# EAGLE design wt32i_breakout_board_v30 (EAGLE 7.5.0)
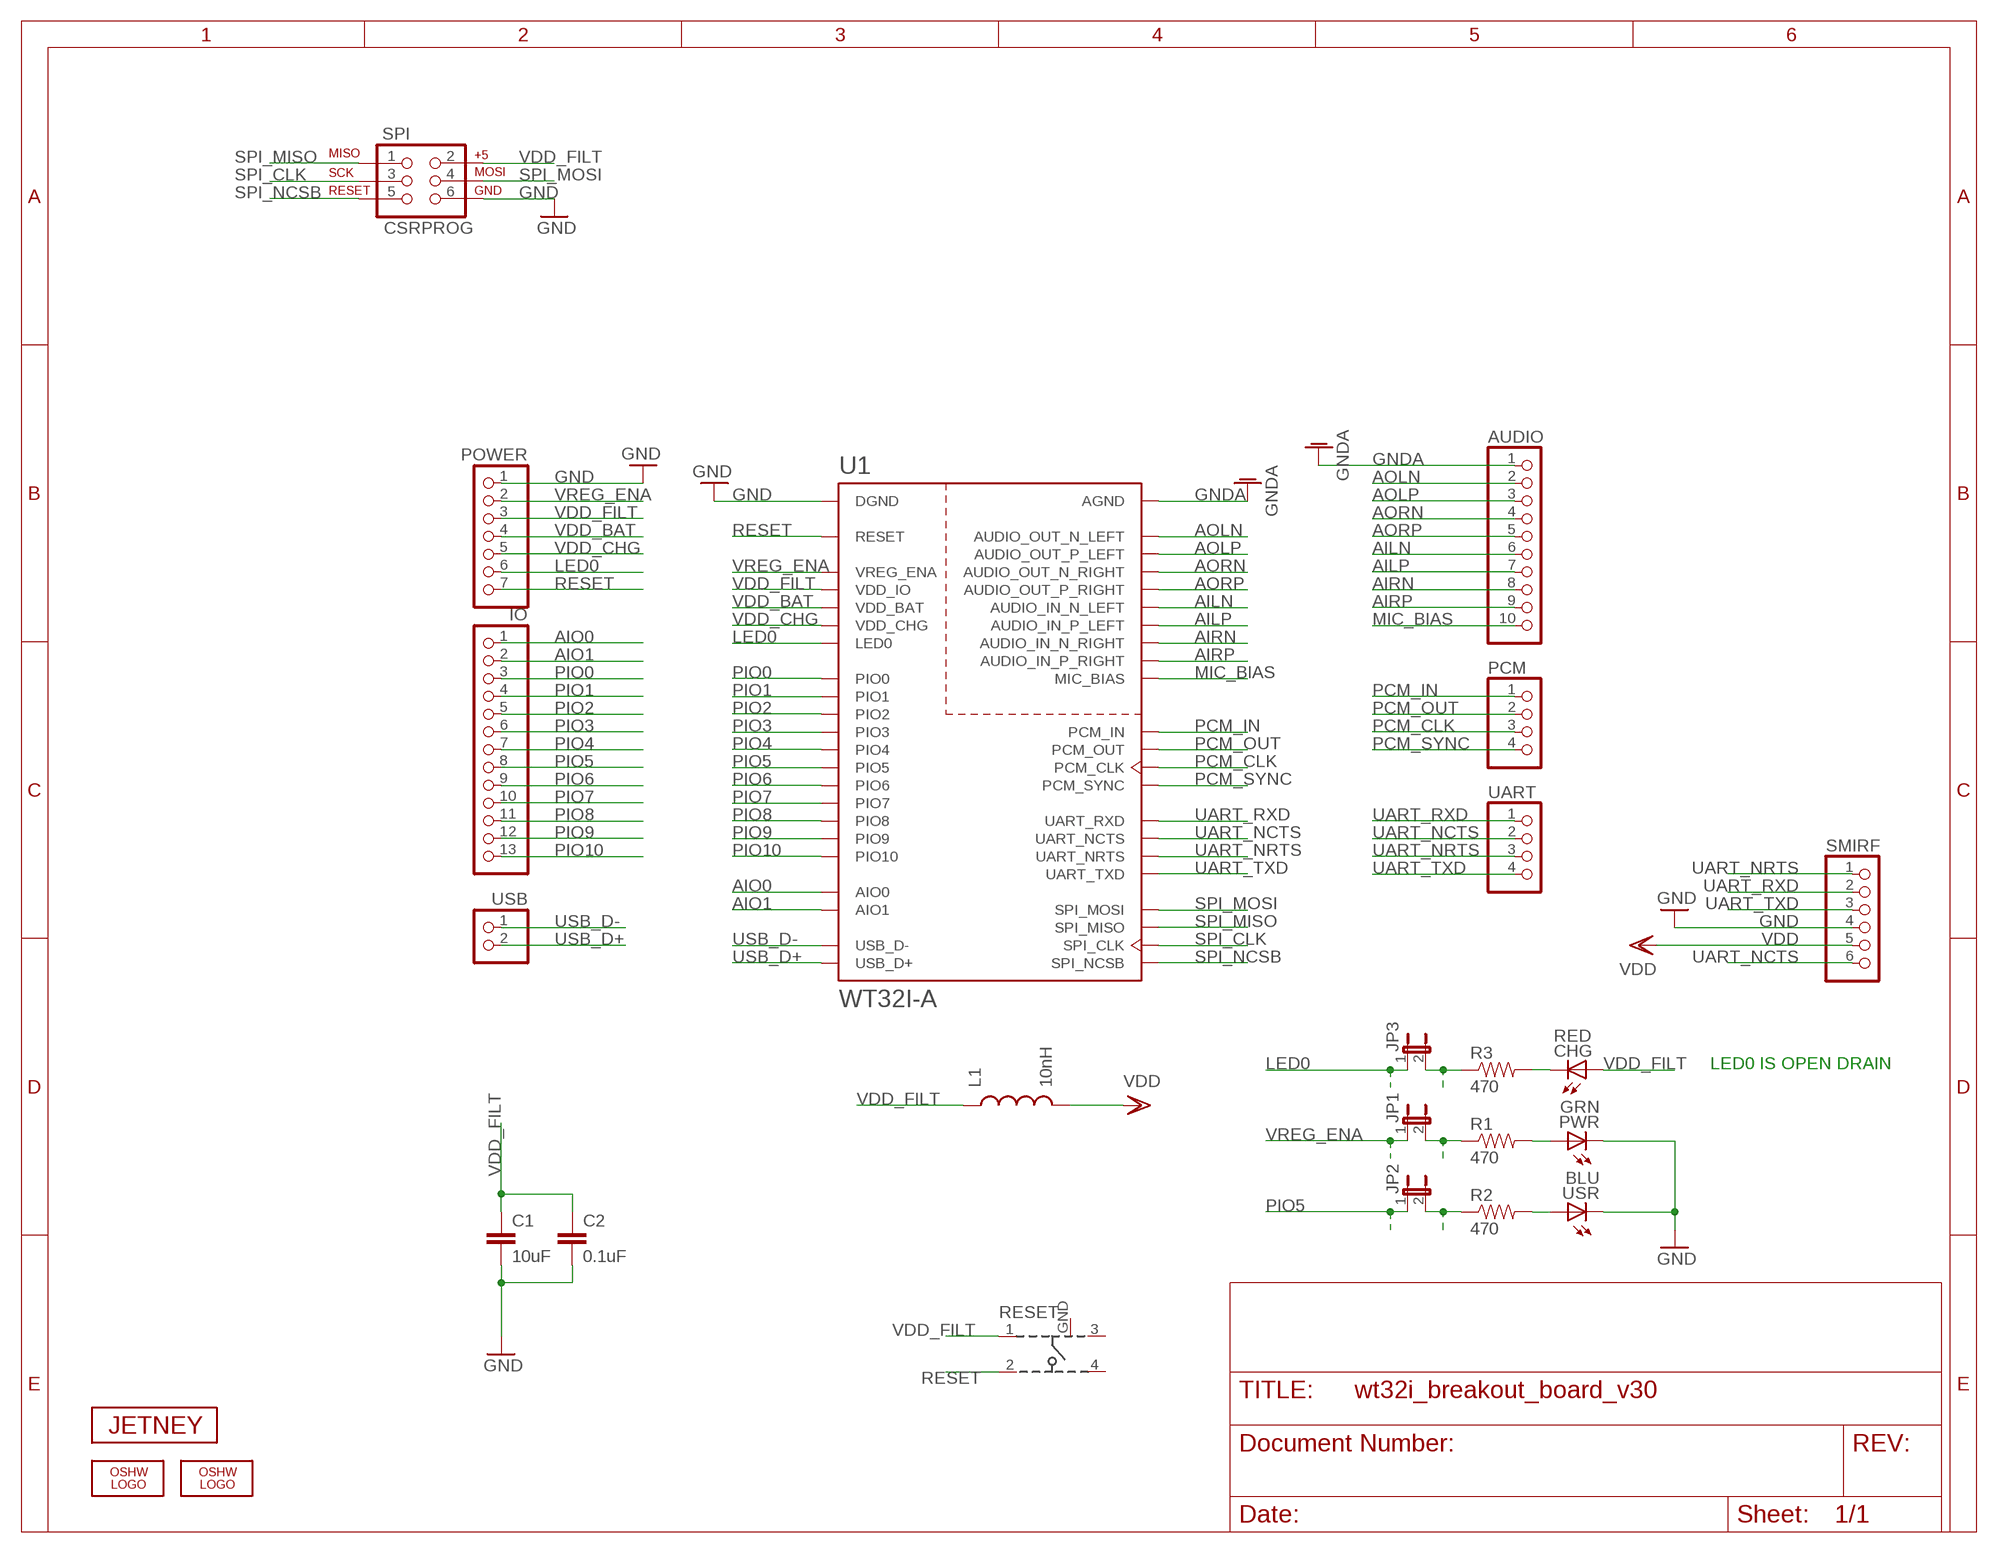
[diagram p0: schematic, sheet 1]

## Parts
AUDIO  PINHD-1X10  [1X10]
C1  10uF  CAP0603-CAP  [0603-CAP]
C2  0.1uF  CAP0603-CAP  [0603-CAP]
CHG  RED  LEDCHIPLED_0805  [CHIPLED_0805]
IO  PINHD-1X13  [1X13]
JP1  JUMPER-2SMD-NC  [SJ_2S]
JP2  JUMPER-2SMD-NC  [SJ_2S]
JP3  JUMPER-2SMD-NC  [SJ_2S]
L1  10nH  INDUCTOR0603  [0603]
LOGO1  OSHW_LOGO_FILLX0070-NT  [OSHW_FILLX70_NOTEXT]
LOGO2  OSHW_LOGO_FILLX0070-NT  [OSHW_FILLX70_NOTEXT]
PCM  PINHD-1X4  [1X04]
POWER  PINHD-1X7  [1X07]
PWR  GRN  LEDCHIPLED_0805  [CHIPLED_0805]
R1  470  RESISTOR0603-RES  [0603-RES]
R2  470  RESISTOR0603-RES  [0603-RES]
R3  470  RESISTOR0603-RES  [0603-RES]
RESET  101-IG  [101-IG]
SMIRF  PINHD-1X6  [1X06]
SPI  CSRPROG  AVR_SPI_PRG_6PTH  [2X3]
U1  WT32I-A  [WT32I-A]
U$2  JETNEY-LOGO-12  [JETNEY-LOGO-12]
UART  PINHD-1X4  [1X04]
USB  PINHD-1X2  [1X02]
USR  BLU  LEDCHIPLED_0805  [CHIPLED_0805]

## Nets
AILN: AUDIO.6 U1.AUDIO_IN_N_LEFT
AILP: AUDIO.7 U1.AUDIO_IN_P_LEFT
AIO0: IO.1 U1.AIO0
AIO1: IO.2 U1.AIO1
AIRN: AUDIO.8 U1.AUDIO_IN_N_RIGHT
AIRP: AUDIO.9 U1.AUDIO_IN_P_RIGHT
AOLN: AUDIO.2 U1.AUDIO_OUT_N_LEFT
AOLP: AUDIO.3 U1.AUDIO_OUT_P_LEFT
AORN: AUDIO.4 U1.AUDIO_OUT_N_RIGHT
AORP: AUDIO.5 U1.AUDIO_OUT_P_RIGHT
GND [power]: C1.2 C2.2 POWER.1 PWR.C SMIRF.4 SPI.6 U1.DGND U1.DGND@2(DGND) U1.DGND@3(DGND) U1.DGND@4(DGND) U1.DGND@5(DGND) USR.C
GNDA: AUDIO.1 U1.AGND U1.AGND@2(AGND) U1.AGND@3(AGND)
LED0: JP3.1 POWER.6 U1.LED0
MIC_BIAS: AUDIO.10 U1.MIC_BIAS
N$1: PWR.A R1.2
N$2: CHG.C R3.2
N$3: R2.2 USR.A
N$4: JP2.2 R2.1
N$7: JP3.2 R3.1
PCM_CLK: PCM.3 U1.PCM_CLK
PCM_IN: PCM.1 U1.PCM_IN
PCM_OUT: PCM.2 U1.PCM_OUT
PCM_SYNC: PCM.4 U1.PCM_SYNC
PIO0: IO.3 U1.PIO0
PIO1: IO.4 U1.PIO1
PIO2: IO.5 U1.PIO2
PIO3: IO.6 U1.PIO3
PIO4: IO.7 U1.PIO4
PIO5: IO.8 JP2.1 U1.PIO5
PIO6: IO.9 U1.PIO6
PIO7: IO.10 U1.PIO7
PIO8: IO.11 U1.PIO8
PIO9: IO.12 U1.PIO9
PIO10: IO.13 U1.PIO10
RESET: POWER.7 RESET.2 U1.RESET
SPI_CLK: SPI.3 U1.SPI_CLK
SPI_MISO: SPI.1 U1.SPI_MISO
SPI_MOSI: SPI.4 U1.SPI_MOSI
SPI_NCSB: SPI.5 U1.SPI_NCSB
UART_NCTS: SMIRF.6 U1.UART_NCTS UART.2
UART_NRTS: SMIRF.1 U1.UART_NRTS UART.3
UART_RXD: SMIRF.2 U1.UART_RXD UART.1
UART_TXD: SMIRF.3 U1.UART_TXD UART.4
USB_D+: U1.USB_D+ USB.2
USB_D-: U1.USB_D- USB.1
VDD [power]: L1.2 SMIRF.5
VDD_BAT [power]: POWER.4 U1.VDD_BAT
VDD_CHG: POWER.5 U1.VDD_CHG
VDD_FILT [power]: C1.1 C2.1 CHG.A L1.1 POWER.3 RESET.1 SPI.2 U1.VDD_IO
VDDJP1 [power]: JP1.2 R1.1
VREG_ENA: JP1.1 POWER.2 U1.VREG_ENA
Unconnected: RESET.3 RESET.4

## Notes on the sheet
- LED0 IS OPEN DRAIN

## Power pins joined to a net without a drawn wire
GND: RESET.GND

## Library data of the parts
AUDIO = sf-pinhead:PINHD-1X10: PIN HEADER
C1 C2 = SparkFun:CAP: Capacitor Standard 0603 ceramic capacitor, and 0.1" leaded capacitor.
CHG PWR USR = adafruit:LED: LED OSRAM: - CHIPLED LG R971, LG N971, LY N971, LG Q971, LY Q971, LO R971, LY R971 LH N974, LH R974 LS Q976, LO Q976, LY Q976 LO Q996 - Hyper CHIPLED LW Q18S LB Q993, LB Q99A, LB R99A - SideLED LS A670, LO A670, LY A670, LG A670, LP A670 LB A673, LV A673, LT A673, LW A673 LH A674 LY A675 LS A676, LA A676, LO A676, LY A676, LW A676 LS A679, LY A679, LG A679 - Hyper Micro SIDELED® LS Y876, LA Y876, LO Y876, LY Y876 LT Y87S - SmartLED LW L88C, LW L88S LB L89C, LB L89S, LG L890 LS L89K, LO L89K, LY L89K LS L896, LA L896, LO L896, LY L896 - TOPLED LS T670, LO T670, LY T670, LG T670, LP T670 LSG T670, LSP T670, LSY T670, LOP T670, LYG T670 LG T671, LOG T671, LSG T671 LB T673, LV T673, LT T673, LW T673 LH T674 LS T676, LA T676, LO T676, LY T676, LB T676, LH T676, LSB T676, LW T676 LB T67C, LV T67C, LT T67C, LS T67K, LO T67K, LY T67K, LW E67C LS E67B, LA E67B, LO E67B, LY E67B, LB E67C, LV E67C, LT E67C LW T67C LS T679, LY T679, LG T679 LS T770, LO T770, LY T770, LG T770, LP T770 LB T773, LV T773, LT T773, LW T773 LH T774 LS E675, LA E675, LY E675, LS T675 LS T776, LA T776, LO T776, LY T776, LB T776 LHGB T686 LT T68C, LB T68C - Hyper Mini TOPLED® LB M676 - Mini TOPLED Santana® LG M470 LS M47K, LO M47K, LY M47K Source: http://www.osram.convergy.de/
IO = sf-pinhead:PINHD-1X13: PIN HEADER
JP1-JP3 = SparkFun:JUMPER-2: Jumper Basic 0.1" spaced jumper. Use with breakaway headers.
L1 = SparkFun:INDUCTOR: Inductors Basic Inductor/Choke - 0603 and 1206. Footprints are not proven and vary greatly between part numbers.
LOGO1 LOGO2 = oshw-logo:OSHW_LOGO_FILL
PCM UART = sf-pinhead:PINHD-1X4: PIN HEADER
POWER = sf-pinhead:PINHD-1X7: PIN HEADER
R1-R3 = SparkFun:RESISTOR: Resistor Basic schematic elements and footprints for 0603, 1206, and PTH resistors.
RESET = sf-keyglove:101-IG
SMIRF = sf-pinhead:PINHD-1X6: PIN HEADER
SPI = SparkFun:AVR_SPI_PRG_6: AVR ISP 6 Pin This is the reduced ISP connector for AVR programming. Common on Arduino. This footprint will take up less PCB space and can be used with a 10-pin to 6-pin adapter such as SKU: BOB-08508
U1 = jetney-silabs-modules:WT32I: Bluegiga WT32 class 2 Bluetooth Audio module - Bluetooth 2.1 + EDR w/stereo analog audio (A2DP) support. WT32-A variant has an on-module ceramic chip antenna, WT32-E variant has W.Fl connector. WT32-A variant includes keepout/restrict area. Antenna edge of the module should be flush up against the edge of the PCB. See datasheet for variant layout details. The WT32 is a Bluetooth 2.1 + EDR module dedicated for Bluetooth audio applications. In addition to Bluetooth radio, antenna and iWRAP Bluetooth stack, the WT32 contains a DSP processor, a stereo audio codec and a battery charger making it ideal for portable battery Bluetooth stereo or hands-free audio applications. The WT32 constitutes an ideal solution for developers that want to quickly integrate the latest Bluetooth audio technologies into their design without investing several months into Bluetooth radio and stack development. In addition to the standard Bluetooth audio profiles, the WT32 can also support aptX® audio coding technology, offering outstanding Bluetooth Stereo audio quality, CVC audio enhancement software for hands-free applications and Apple iAP profile enabling OEMs, to create really unique and differentiated audio products. http://www.bluegiga.com/en-US/products/bluetooth-classic-modules/wt32-bluetooth--audio-module https://github.com/jrowberg/sf-oshw Last updated 2014-01-04 by Jeff Rowberg <jeff@rowberg.net>; ANTENNA: On-module ceramic chip antenna
U$2 = sf-keyglove:JETNEY-LOGO
USB = sf-pinhead:PINHD-1X2: PIN HEADER

## Net classes
0 default: width 0.152 mm, drill 0.33 mm, clearance 0.152 mm
1 power: width 0.254 mm, drill 0.33 mm, clearance 0.152 mm

## Board
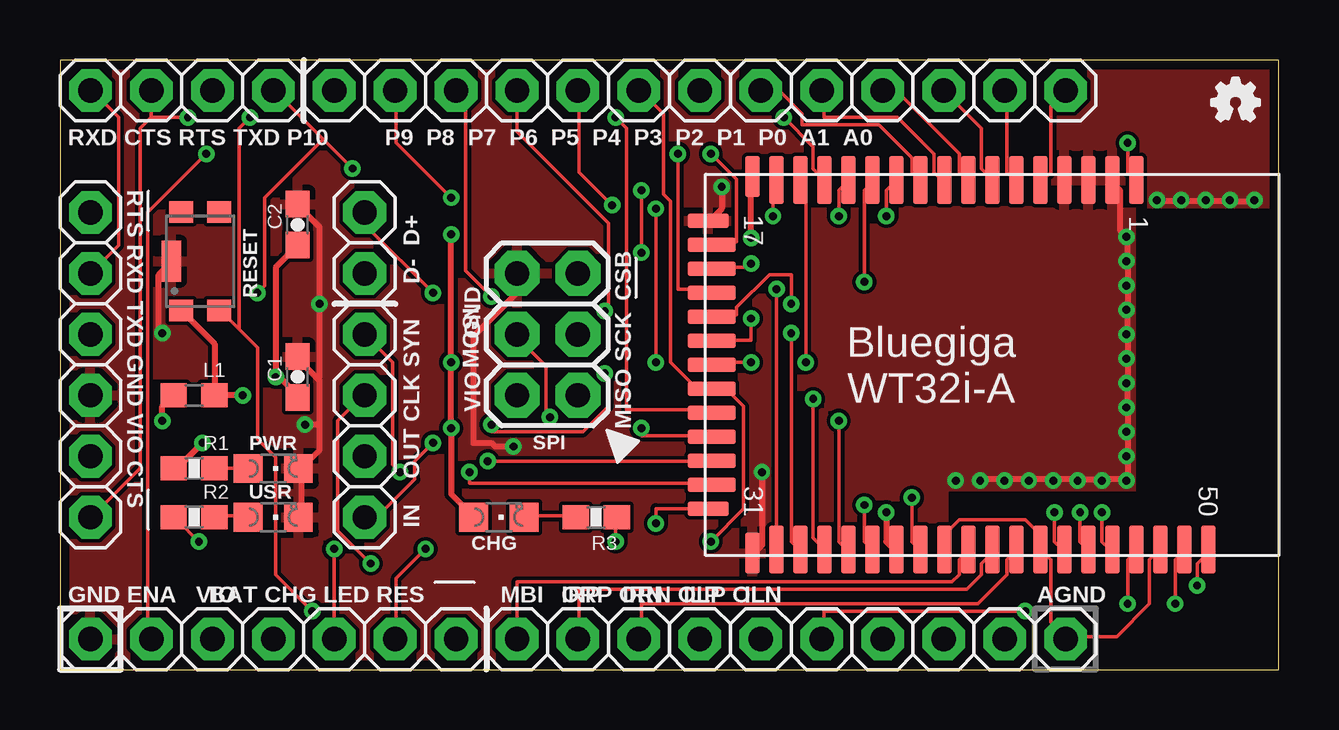
[diagram p1: board, top side]
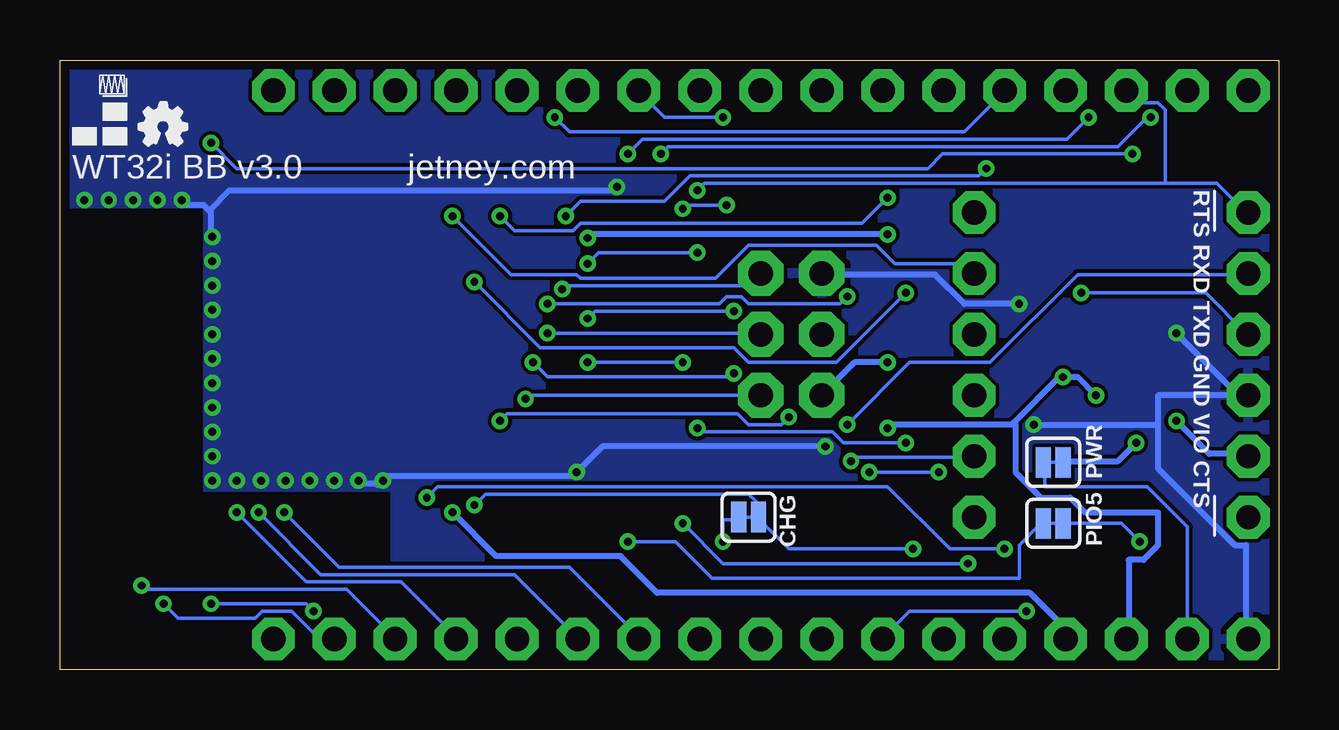
[diagram p2: board, bottom side, seen from below]

Size 50.8 x 25.4 mm. Coordinates in mm from the lower left corner, seen from the top.
Outline: 0,0 50.8,0 50.8,25.4 0,25.4 0,0
Copper layers (1*16): Top 0.0356mm / dielectric 1.5011mm / Bottom 0.0356mm
Design rules "LaenPCBOrder *": minimum track width 6mil, minimum drill 13mil, track to track 6mil, track to pad 6mil, pad to pad 6mil, via to via 6mil, smd to smd 6mil, copper to edge 15mil, drill to drill 6mil, minimum pad ring 7mil, minimum via ring 7mil, stop-mask expansion 4mil, vias tented up to drill 13mil, thermal gap 10mil
vRestrict: area 2.5,5.1 to 3.8,20.3; area 7.9,7.1 to 9.4,7.6; area 7.9,9.1 to 9.4,9.7; area 17.3,5.1 to 18.8,5.6; area 0,21.8 to 43.2,22.6; area 0,2.8 to 43.2,3.6; area 16.8,10.2 to 17.5,17.8; area 23.1,10.2 to 23.9,17.8

### Footprints (pad centres in the part's own frame; a part is rotated, then mirrored left to right if it is on the bottom)
1X10 = drill 1.016 pad 1.778 octagon: 1 -11.43,0; 2 -8.89,0; 3 -6.35,0; 4 -3.81,0; 5 -1.27,0; 6 1.27,0; 7 3.81,0; 8 6.35,0; 9 8.89,0; 10 11.43,0
0603-CAP = smd 1.1 x 1: 1 -0.85,0; 2 0.85,0
CHIPLED_0805 = smd 1.2 x 1.2: A 0,-1.05; C 0,1.05
1X13 = drill 1.016 pad 1.778 octagon: 1 -15.24,0; 2 -12.7,0; 3 -10.16,0; 4 -7.62,0; 5 -5.08,0; 6 -2.54,0; 7 0,0; 8 2.54,0; 9 5.08,0; 10 7.62,0; 11 10.16,0; 12 12.7,0; 13 15.24,0
SJ_2S = smd 0.635 x 1.27: 1 -0.412,0; 2 0.412,0
0603 = smd 1.1 x 1: 1 -0.85,0; 2 0.85,0
1X04 = drill 1.016 pad 1.778 octagon: 1 -3.81,0; 2 -1.27,0; 3 1.27,0; 4 3.81,0
1X07 = drill 1.016 pad 1.778 octagon: 1 -7.62,0; 2 -5.08,0; 3 -2.54,0; 4 0,0; 5 2.54,0; 6 5.08,0; 7 7.62,0
0603-RES = smd 1.1 x 1: 1 -0.85,0; 2 0.85,0
101-IG = smd 0.9 x 1: 1 -2.05,0.8; 2 -2.05,-0.8; 3 2.05,0.8; 4 2.05,-0.8 | smd 1.7 x 0.8: GND 0,1.2
1X06 = drill 1.016 pad 1.778 octagon: 1 -6.35,0; 2 -3.81,0; 3 -1.27,0; 4 1.27,0; 5 3.81,0; 6 6.35,0
2X3 = drill 1.016 pad 1.88 octagon: 1 0,0; 2 0,2.54; 3 2.54,0; 4 2.54,2.54; 5 5.08,0; 6 5.08,2.54
WT32I-A = smd 2 x 0.6: AGND 7.7,-2; AGND@2 7.7,2; AGND@3 7.7,7; AIO0 -7.7,2; AIO1 -7.7,1; AUDIO_IN_N_LEFT 7.7,4; AUDIO_IN_N_RIGHT 7.7,1; AUDIO_IN_P_LEFT 7.7,3; AUDIO_IN_P_RIGHT 7.7,0; AUDIO_OUT_N_LEFT 7.7,8; AUDIO_OUT_N_RIGHT 7.7,5; AUDIO_OUT_P_LEFT 7.7,9; AUDIO_OUT_P_RIGHT 7.7,6; DGND -7.7,5; DGND@2 -7.7,4; DGND@3 -7.7,3; LED0 7.7,-5; MIC_BIAS 7.7,-1; PIO0 -7.7,0; PIO1 -7.7,-1; PIO2 -7.7,-2; PIO3 -7.7,-3; PIO9 -7.7,-6; PIO10 -7.7,-7; SPI_CLK 7.7,-8; SPI_MISO 7.7,-7; SPI_MOSI 7.7,-6; SPI_NCSB 7.7,-9; UART_RXD -7.7,-8; UART_TXD -7.7,-9; USB_D+ -7.7,-5; USB_D- -7.7,-4; VDD_BAT 7.7,-4; VDD_CHG 7.7,-3; VREG_ENA -7.7,6 | smd 0.6 x 1.7: DGND@4 -6,-11.85; PCM_CLK 6,-11.85 | smd 1.7 x 0.6: DGND@5 7.85,-10; VDD_IO -7.85,-10 | smd 0.6 x 2: PCM_IN 3,-11.7; PCM_OUT 4,-11.7; PCM_SYNC 5,-11.7; PIO4 2,-11.7; PIO5 1,-11.7; PIO6 0,-11.7; PIO7 -1,-11.7; PIO8 -2,-11.7; RESET -5,-11.7; UART_NCTS -3,-11.7; UART_NRTS -4,-11.7
1X02 = drill 1.016 pad 1.778 octagon: 1 -1.27,0; 2 1.27,0

### Placement (x,y rotation side)
AUDIO  30.48,1.27 180 top
C1  9.91,12.19 90 top
C2  9.91,18.54 90 top
CHG  18.29,6.35 270 top
IO  26.67,24.13 180 top
JP1  9.4,8.64 0 bottom
JP2  9.4,6.1 0 bottom
JP3  22.1,6.35 180 bottom
L1  5.59,11.43 180 top
LOGO1  48.01,22.86 0 top
LOGO2  47.5,21.84 0 bottom
PCM  12.7,10.16 90 top
POWER  8.89,1.27 0 top
PWR  8.89,8.38 270 top
R1  5.59,8.38 0 top
R2  5.59,6.35 0 top
R3  22.35,6.35 180 top
RESET  5.84,17.02 90 top
SMIRF  1.27,12.7 270 top
SPI  21.59,11.43 90 top
U1  38.86,12.7 270 top
U$2  50.29,21.84 0 bottom
UART  5.08,24.13 0 top
USB  12.7,17.78 90 top
USR  8.89,6.35 270 top

### Tracks (layer width: path | path; a pad name or v marks a point on that pad's centre or on a via)
AILN  (via drill 0.33)
  Top 0.152: v42.52,6.55 42.52,5.33 42.82,5.03 U1.AUDIO_IN_N_LEFT
  Bottom 0.152: v42.52,6.55 39.93,3.96 31.85,3.96 29.26,1.37 AUDIO.6
AILP  (via drill 0.33)
  Top 0.152: v41.45,6.55 41.45,5.33 41.76,5.03 41.83,5.03 U1.AUDIO_IN_P_LEFT
  Bottom 0.152: v41.45,6.55 39.17,4.27 29.57,4.27 26.67,1.37 AUDIO.7
AIO0
  Top 0.152: IO.1 41.91,24.08 41.3,23.47 41.3,20.73 41,20.42 40.92,20.42 U1.AIO0
AIO1
  Top 0.152: IO.2 39.47,24.08 39.47,20.73 39.78,20.42 39.85,20.42 U1.AIO1
AIRN
  Top 0.152: AUDIO.8 24.23,1.37 24.23,2.74 38.25,2.74 39.47,3.96 39.47,4.57 39.85,4.95 U1.AUDIO_IN_N_RIGHT
AIRP
  Top 0.152: AUDIO.9 21.64,1.37 21.64,3.35 37.8,3.35 38.41,3.96 38.41,4.42 38.86,4.88 U1.AUDIO_IN_P_RIGHT
AOLN  (via drill 0.33)
  Top 0.152: v46.48,2.74 46.48,4.57 46.79,4.88 46.79,4.95 U1.AUDIO_OUT_N_LEFT
  Bottom 0.152: v46.48,2.74 45.87,2.13 42.67,2.13 42.37,2.44 41.15,2.44 40.08,1.37 39.47,1.37 AUDIO.2
AOLP  (via drill 0.33)
  Top 0.152: v47.4,3.5 47.4,4.42 47.85,4.88 47.85,4.95 U1.AUDIO_OUT_P_LEFT
  Bottom 0.152: v47.4,3.5 47.24,3.35 38.86,3.35 36.88,1.37 AUDIO.3
AORN  (via drill 0.33)
  Top 0.152: v43.43,6.55 43.43,5.33 43.74,5.03 43.81,5.03 U1.AUDIO_OUT_N_RIGHT
  Bottom 0.152: v43.43,6.55 40.54,3.66 36.58,3.66 34.29,1.37 AUDIO.4
AORP  (via drill 0.33)
  Top 0.152: v44.5,2.74 44.5,4.57 44.81,4.88 44.81,4.95 U1.AUDIO_OUT_P_RIGHT | v40.23,2.44 31.85,2.44 31.85,1.37 AUDIO.5
  Bottom 0.152: v44.5,2.74 40.54,2.74 v40.23,2.44
GND  (via drill 0.33)
  Top 0.254: 40.39,7.92 39.47,7.92 v39.37,7.87 39.32,7.92 38.41,7.92 v38.35,7.87 | 43.43,7.92 42.52,7.92 v42.42,7.87 42.37,7.92 41.45,7.92 v41.4,7.87 41.3,7.92 40.39,7.92 | 40.39,7.92 v40.39,7.87 | v45.72,19.56 45.72,19.51 46.63,19.51 v46.74,19.56 46.79,19.51 47.7,19.51 v47.75,19.56 47.85,19.51 48.77,19.51 | 48.77,19.51 49.68,19.51 v49.78,19.56 | 48.77,19.51 v48.77,19.56 | 44.5,9.91 44.5,10.82 v44.45,10.92 44.5,10.97 44.5,11.89 v44.45,11.94 44.5,12.04 44.5,12.95 | 44.5,9.91 44.5,8.99 v44.45,8.89 44.5,8.84 44.5,7.92 v44.45,7.87 44.35,7.92 43.43,7.92 | 44.5,9.91 v44.45,9.91 | 44.5,12.95 44.5,13.87 v44.45,13.97 44.5,14.02 44.5,14.94 v44.45,14.99 44.5,15.09 44.5,16 | 44.5,16 44.5,16.92 v44.45,17.02 44.5,17.07 44.5,17.98 v44.45,18.03 44.2,18.29 44.2,19.96 43.89,20.27 | 44.5,16 v44.45,16 | 44.5,12.95 v44.45,12.95 | 43.43,7.92 v43.43,7.87 | 27.13,18.75 27.58,19.2 v27.58,20.12 | 28.96,4.88 29.26,5.18 v29.26,8.23 | v4.27,14.02 4.12,14.17 4.12,16.46 4.57,16.92 RESET.GND | 10.74,12.12 10.82,12.04 10.82,10.21 | 10.74,12.12 9.91,12.95 C1.2 | 10.82,10.21 10.82,9.14 10.06,8.38 | C2.2 9.91,19.36 10.82,18.44 v10.82,15.24 10.82,12.19 10.74,12.12 | 10.06,8.38 10.06,6.4 USR.C | 10.06,8.38 PWR.C | 10.82,10.21 v10.21,10.21 | v18.9,9.3 18.14,9.3 17.98,9.45 17.22,9.45 17.22,13.87 19.05,15.7 SPI.6
  Bottom 0.254: v38.35,7.87 38.25,7.77 37.64,7.77 37.57,7.7 37.49,7.77 37.34,7.77 v37.34,7.87 37.34,7.92 37.19,8.08 29.41,8.08 v29.26,8.23 28.19,9.3 v18.9,9.3 | 44.58,19.13 44.5,19.05 44.5,18.14 v44.45,18.03 | 44.58,19.13 44.81,19.36 45.57,19.36 45.72,19.51 v45.72,19.56 | 47.7,19.66 v47.75,19.56 | v27.58,20.12 27.74,19.96 43.74,19.96 44.58,19.13 | v4.27,14.02 1.68,11.43 SMIRF.4 5.03,11.43 5.03,10.21 | 5.03,10.21 5.03,8.38 1.83,5.18 1.37,5.18 1.37,1.37 POWER.1 | v10.82,15.24 13.11,15.24 14.33,16.46 19.05,16.46 SPI.6 | v10.21,10.21 5.03,10.21
  pour Top: 0,25.4 50.8,25.4 50.8,7.62 36.83,7.62 36.83,0 0,0
  pour Bottom: 0,25.4 50.8,25.4 50.8,7.62 36.83,7.62 36.83,0 0,0
GNDA
  Top 0.152: 41.91,1.37 41.3,1.98 41.3,4.57 40.92,4.95 U1.AGND@2 40.84,5.03 40.84,5.64 40.23,6.25 37.49,6.25 36.88,5.64 36.88,5.03 U1.AGND | 41.91,1.37 44.04,1.37 45.41,2.74 45.41,4.57 45.8,4.95 U1.AGND@3 | 41.91,1.37 AUDIO.1
  Bottom 0.152: 41.91,1.37 AUDIO.1
LED0  (via drill 0.33)
  Top 0.152: v15.24,5.03 14.02,3.81 14.02,1.37 POWER.6 | v33.53,6.86 33.53,5.33 U1.LED0
  Bottom 0.152: v15.24,5.03 20.42,5.03 21.64,6.25 JP3.1 21.79,6.4 21.79,7.01 22.1,7.32 33.07,7.32 v33.53,6.86
MIC_BIAS
  Top 0.152: AUDIO.10 19.05,3.66 37.19,3.66 37.49,3.96 37.49,4.57 37.8,4.88 37.8,4.95 U1.MIC_BIAS
N$1
  Top 0.152: PWR.A R1.2
N$2
  Top 0.152: R3.2 21.49,6.4 19.36,6.4 CHG.C
N$3
  Top 0.152: R2.2 6.55,6.4 7.77,6.4 USR.A
N$4  (via drill 0.33)
  Top 0.152: v5.79,5.33 4.88,6.25 R2.1
  Bottom 0.152: v5.79,5.33 6.55,6.1 JP2.2
N$5
  Bottom 0.152: 9.14,6.1 9.65,6.1
N$6
  Bottom 0.152: 9.14,8.64 9.65,8.64
N$7  (via drill 0.33)
  Top 0.152: v23.16,5.33 23.16,6.25 R3.1
  Bottom 0.152: v23.16,5.33 23.16,6.25 22.55,6.25 JP3.2
N$8
  Bottom 0.152: 22.35,6.35 21.84,6.35
PCM_CLK  (via drill 0.33)
  Top 0.152: v24.84,6.1 24.84,6.71 26.98,6.71 U1.PCM_CLK | v12.95,4.42 11.58,5.79 11.58,10.36 12.65,11.43 PCM.3
  Bottom 0.152: v24.84,6.1 23.16,4.42 v12.95,4.42
PCM_IN  (via drill 0.33)
  Top 0.152: v24.23,10.06 24.23,9.75 27.13,9.75 U1.PCM_IN | v15.54,9.45 14.78,8.69 14.78,7.92 13.26,6.4 12.8,6.4 PCM.1
  Bottom 0.152: v24.23,10.06 24.08,9.91 18.59,9.91 18.14,9.45 v15.54,9.45
PCM_OUT  (via drill 0.33)
  Top 0.152: v17.83,8.69 27.13,8.69 U1.PCM_OUT
  Bottom 0.152: v17.83,8.69 17.68,8.84 12.8,8.84 PCM.2
PCM_SYNC  (via drill 0.33)
  Top 0.152: v17.07,8.23 17.07,7.77 27.13,7.77 U1.PCM_SYNC | v14.17,8.23 13.87,8.53 13.87,12.8 PCM.4
  Bottom 0.152: v14.17,8.23 v17.07,8.23
PIO0
  Top 0.152: IO.3 38.41,22.55 38.41,20.88 38.86,20.42 U1.PIO0
PIO1
  Top 0.152: IO.4 34.29,24.08 34.9,24.08 37.49,21.49 37.49,20.73 37.8,20.42 U1.PIO1
PIO2
  Top 0.152: IO.5 31.85,24.08 31.85,23.01 34.9,23.01 36.42,21.49 36.42,20.73 36.73,20.42 36.8,20.42 U1.PIO2
PIO3
  Top 0.152: IO.6 29.26,24.08 30.02,24.08 30.94,23.16 30.94,22.71 34.14,22.71 35.51,21.34 35.51,20.73 35.81,20.42 U1.PIO3
PIO4  (via drill 0.33)
  Top 0.152: v23.16,23.01 23.62,22.55 23.62,10.82 27.13,10.82 27.13,10.74 U1.PIO4
  Bottom 0.152: v23.16,23.01 25.6,23.01 26.67,24.08 IO.7
PIO5  (via drill 0.33)
  Top 0.152: v27.13,5.33 28.5,6.71 28.5,10.97 27.89,11.58 27.28,11.58 U1.PIO5 27.13,11.73 26.52,11.73 25.45,12.8 25.45,19.51 25.15,19.81 25.15,23.16 24.23,24.08 IO.8
  Bottom 0.152: v27.13,5.33 25.15,5.33 23.62,3.81 10.82,3.81 10.82,5.18 9.91,6.1 JP2.1
PIO6  (via drill 0.33)
  Top 0.152: v28.8,12.8 27.28,12.8 27.2,12.72 U1.PIO6 | v24.84,19.2 v24.84,12.8 | v23.01,19.36 21.64,20.73 21.64,24.08 IO.9
  Bottom 0.152: v24.84,12.8 v28.8,12.8 | v24.84,19.2 24.69,19.36 v23.01,19.36
PIO7  (via drill 0.33)
  Top 0.152: v28.8,14.63 28.8,13.72 27.2,13.72 U1.PIO7 | v22.71,14.94 22.86,15.09 22.86,18.59 19.05,22.4 IO.10
  Bottom 0.152: v28.8,14.63 28.5,14.94 v22.71,14.94
PIO8  (via drill 0.33)
  Top 0.152: v30.48,15.24 30.48,16.46 29.57,16.46 28.19,15.09 28.19,14.78 27.28,14.78 27.2,14.71 U1.PIO8 | v17.98,15.54 16.92,16.61 16.92,23.77 16.61,24.08 IO.11
  Bottom 0.152: v30.48,15.24 23.32,15.24 23.01,15.54 22.4,15.54 22.1,15.24 18.29,15.24 v17.98,15.54
PIO9  (via drill 0.33)
  Top 0.152: v32.46,18.9 32.46,19.96 32.84,20.34 U1.PIO9 | v16.31,19.66 14.02,21.95 14.02,24.08 IO.12
  Bottom 0.152: v32.46,18.9 31.85,18.29 29.41,18.29 29.11,18.59 17.37,18.59 v16.31,19.66
PIO10  (via drill 0.33)
  Top 0.152: v30.18,23.01 31.39,21.79 31.39,20.88 31.85,20.42 U1.PIO10
  Bottom 0.152: v30.18,23.01 29.57,22.4 13.11,22.4 11.43,24.08 IO.13
RESET  (via drill 0.33)
  Top 0.152: 7.47,14.17 8.23,13.41 8.23,9.6 8.99,8.84 8.99,3.96 v10.52,2.44 | 7.47,14.17 6.71,14.94 RESET.2 | v27.13,21.49 28.19,20.42 28.19,17.83 27.28,17.83 27.2,17.75 U1.RESET | v7.92,23.01 7.47,22.55 7.47,14.17
  Bottom 0.152: v10.52,2.44 15.39,2.44 16.46,1.37 POWER.7 | v27.13,21.49 26.52,22.1 8.84,22.1 v7.92,23.01
SPI_CLK  (via drill 0.33)
  Top 0.152: v30.48,14.02 30.48,5.33 30.79,5.03 30.86,5.03 U1.SPI_CLK
  Bottom 0.152: v30.48,14.02 21.64,14.02 SPI.3
SPI_MISO  (via drill 0.33)
  Top 0.152: v31.39,11.28 31.39,5.49 31.85,5.03 U1.SPI_MISO
  Bottom 0.152: v31.39,11.28 31.24,11.43 SPI.1
SPI_MOSI  (via drill 0.33)
  Top 0.152: v32.46,10.36 32.46,5.33 32.77,5.03 32.84,5.03 U1.SPI_MOSI | v20.42,10.52 20.27,10.67 20.27,12.65 19.05,13.87 SPI.4
  Bottom 0.152: v32.46,10.36 32.16,10.67 22.55,10.67 22.1,10.21 20.73,10.21 v20.42,10.52
SPI_NCSB  (via drill 0.33)
  Top 0.152: v29.87,15.85 29.87,5.03 U1.SPI_NCSB
  Bottom 0.152: v29.87,15.85 29.72,16 22.1,16 SPI.5
UART_NCTS  (via drill 0.33)
  Top 0.152: v25.76,21.49 25.76,15.85 27.13,15.85 27.13,15.77 U1.UART_NCTS | 3.81,23.01 v5.33,23.01 | UART.2 3.81,23.01 | 3.81,23.01 3.35,22.55 3.35,8.38 1.37,6.4 SMIRF.6
  Bottom 0.152: v25.76,21.49 25.45,21.79 6.71,21.79 5.49,23.01 v5.33,23.01
UART_NRTS  (via drill 0.33)
  Top 0.152: v28.8,16.92 28.8,16.76 27.2,16.76 U1.UART_NRTS | v24.23,19.96 v24.23,17.37
  Bottom 0.152: v28.8,16.92 28.35,17.37 v24.23,17.37 | v24.23,19.96 23.93,20.27 4.72,20.27 | 4.72,20.27 2.59,20.27 1.37,19.05 SMIRF.1 | 4.72,20.27 4.72,23.32 5.03,23.62 5.79,23.62 6.25,24.08 UART.3
UART_RXD  (via drill 0.33)
  Top 0.152: v31.09,12.8 31.09,20.12 30.94,20.27 30.94,20.34 U1.UART_RXD | v22.71,12.34 22.86,12.19 22.86,10.97 21.79,9.91 17.98,9.91 v17.98,10.21 | SMIRF.2 2.44,17.68 2.44,23.01 1.37,24.08 UART.1
  Bottom 0.152: v31.09,12.8 30.48,12.19 22.86,12.19 v22.71,12.34 | v17.98,10.21 15.39,12.8 12.04,12.8 8.38,16.46 1.37,16.46 SMIRF.2
UART_TXD  (via drill 0.33)
  Top 0.152: v29.72,18.9 29.72,20.27 29.79,20.34 U1.UART_TXD | 10.97,22.1 8.99,24.08 UART.4 | 10.97,22.1 v12.19,20.88 | v8.23,15.7 8.53,16 8.53,19.66 10.97,22.1
  Bottom 0.152: v29.72,18.9 29.11,19.51 25.6,19.51 24.54,20.57 12.5,20.57 v12.19,20.88 | v8.23,15.7 3.05,15.7 1.37,14.02 SMIRF.3
USB_D+  (via drill 0.33)
  Top 0.152: v33.53,16.15 33.53,19.96 33.83,20.27 33.83,20.34 U1.USB_D+ | v15.54,15.7 12.8,18.44 12.8,19.05 USB.2
  Bottom 0.152: v33.53,16.15 30.79,13.41 22.71,13.41 22.1,12.8 18.44,12.8 v15.54,15.7
USB_D-  (via drill 0.33)
  Top 0.152: v34.44,18.9 34.44,19.96 34.82,20.34 U1.USB_D-
  Bottom 0.152: v34.44,18.9 32,16.46 29.26,16.46 29.11,16.31 23.47,16.31 22.1,17.68 16.76,17.68 16,16.92 13.11,16.92 USB.1
VDD  (via drill 0.33)
  Top 0.254: 5.03,11.58 4.88,11.43 L1.2 4.72,11.43 4.27,10.97 v4.27,10.36
  Bottom 0.254: v4.27,10.36 2.9,8.99 1.37,8.99 SMIRF.5
VDD_BAT  (via drill 0.33)
  Top 0.254: v34.44,6.55 34.44,5.33 34.75,5.03 34.82,5.03 U1.VDD_BAT
  Bottom 0.254: v34.44,6.55 32.61,4.72 27.43,4.72 25.91,3.2 10.36,3.2 8.99,1.83 8.99,1.37 POWER.4
VDD_CHG  (via drill 0.33)
  Top 0.152: v35.51,7.16 35.51,5.33 35.81,5.03 U1.VDD_CHG | POWER.5 v11.43,5.03
  Bottom 0.152: v35.51,7.16 35.05,7.62 16.31,7.62 13.72,5.03 v11.43,5.03
VDD_FILT  (via drill 0.33)
  Top 0.254: 9.07,12.27 8.99,12.34 8.99,16.76 9.91,17.68 C2.1 | 9.07,12.27 9.91,11.43 C1.1 | v7.62,11.43 L1.1 6.44,13.57 RESET.1 | v8.99,12.19 9.07,12.27 | CHG.A 17.22,6.4 16.31,7.32 v16.31,10.06 v16.31,12.8 v16.31,18.14 | v28.8,17.98 28.8,20.42 28.88,20.5 U1.VDD_IO
  Bottom 0.254: v7.62,11.43 8.38,12.19 v8.99,12.19 9.14,12.19 11.05,10.29 | v16.31,10.06 16.15,10.21 11.12,10.21 11.05,10.29 | v28.8,17.98 28.65,18.14 v16.31,18.14 | POWER.3 6.25,1.37 6.25,4.57 5.64,4.57 5.03,5.18 5.03,6.55 8.08,6.55 8.69,7.16 9.91,7.16 10.97,8.23 10.97,10.21 11.05,10.29 | SPI.2 17.68,12.8 v16.31,12.8
VDDJP1  (via drill 0.33)
  Top 0.254: v5.94,9.45 4.88,8.38 R1.1
  Bottom 0.254: v5.94,9.45 6.71,8.69 8.84,8.69 JP1.2
VREG_ENA  (via drill 0.33)
  Top 0.152: v44.5,21.95 44.5,20.73 44.81,20.42 U1.VREG_ENA | v6.1,21.49 3.66,19.05 3.66,1.52 3.81,1.37 POWER.2
  Bottom 0.152: POWER.2 3.81,5.94 5.49,7.62 9.75,7.62 9.75,8.53 JP1.1 | v44.5,21.95 43.43,20.88 14.63,20.88 14.02,21.49 v6.1,21.49

### Text on the board
tPlace: RXD CTS RTS TXD P10 | P9 P8 P7 P6 P5 P4 P3 P2 P1 P0 A1 A0 | RTS RXD TXD GND VIO CTS | CSB | D- D+ | MOSI | SCK | MISO | Bluegiga / WT32i-A | VIO GND | OUT CLK SYN | IN | GND ENA BAT CHG LED RES ORP ORN OLP OLN | VIO | MBI | IRP | IRN | ILP | ILN | AGND
bPlace: RTS RXD TXD GND VIO CTS | jetney.com | WT32i BB v3.0 | PWR | CHG | PIO5